# Altium schematic sheet ESP_BLE.SchDoc
size 400 x 320 mm
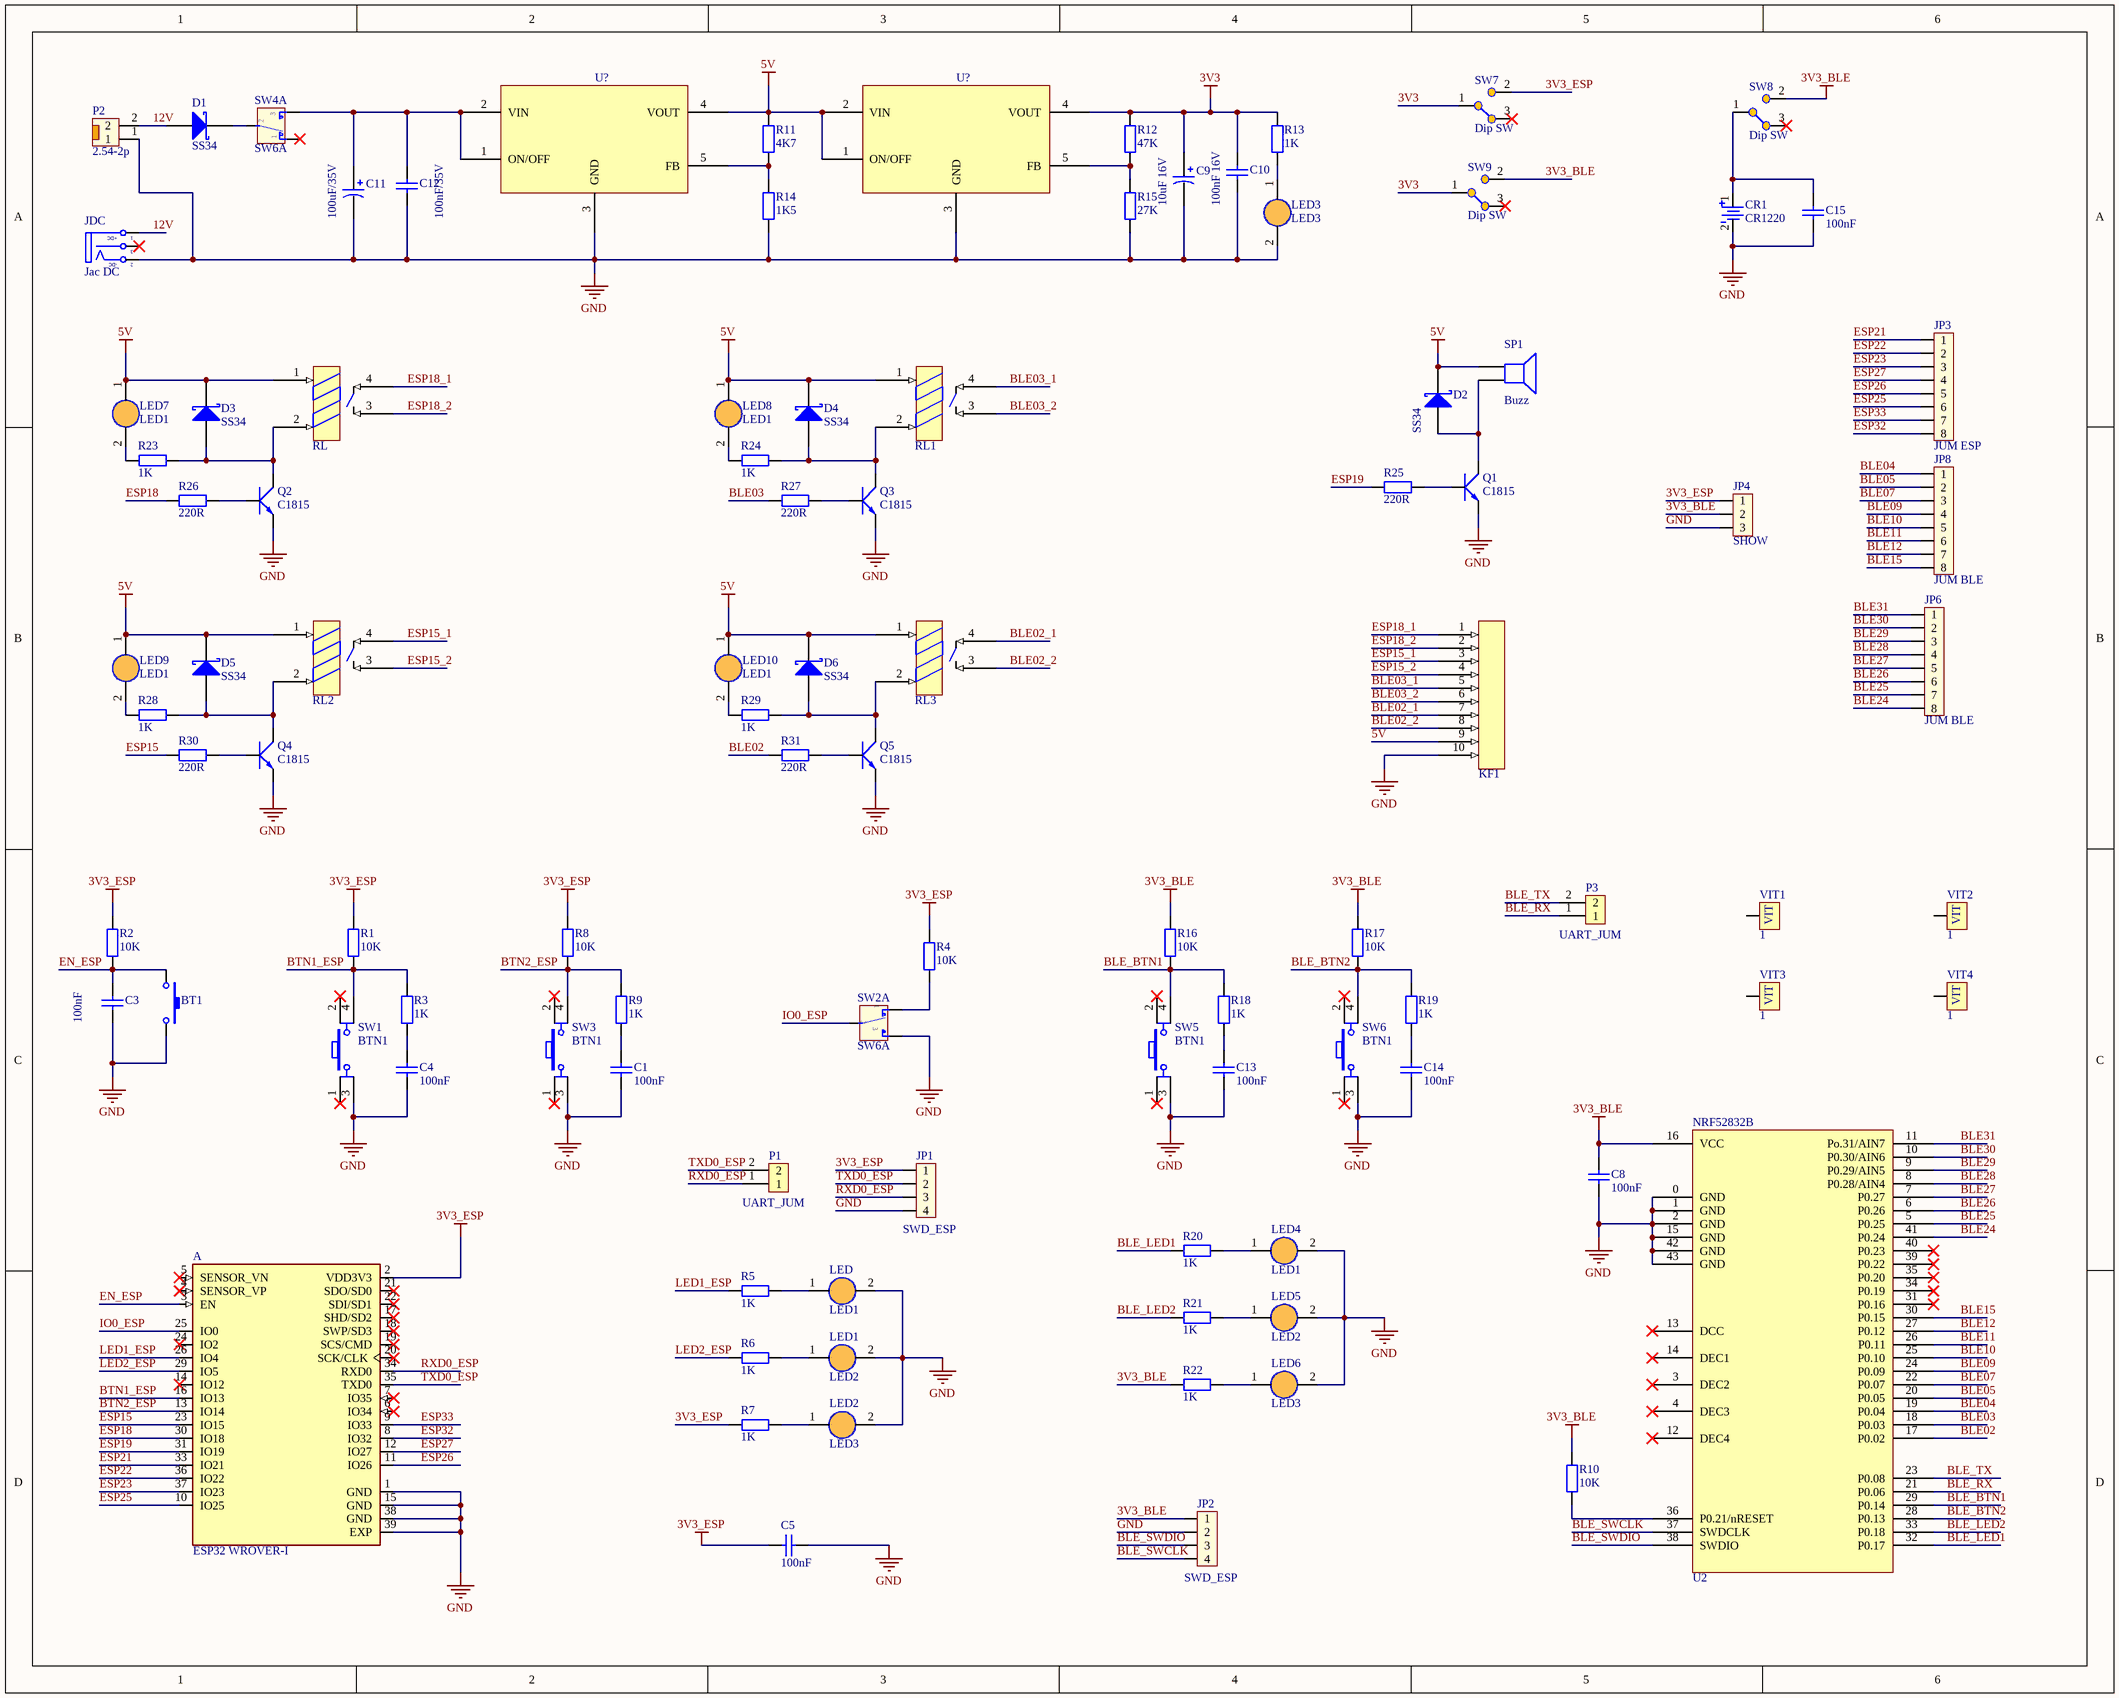
[diagram p0: ESP_BLE.SchDoc]

## Parts
A  ESP32 WROVER-I  [ESP32-WROVER-I]
BT1  Nút Nhấn 2 Chân 3x6x2.5MM SMD  [Nut Nhan 2 Chan SMD_N]  (value not drawn)
C1  100nF  [tu 0805]
C3  100nF  [tu 0805]
C4  100nF  [tu 0805]
C5  100nF  [tu 0805]
C8  100nF  [tu 0805]
C9  10uF 16V  [CAP_ALUM_SMD_5054_TYPE_C]
C10  100nF 16V  [tu 0805]
C11  100uF/35V  [CAP_ALUM_SMD_100102_TYPE_G]
C12  100nF/35V  [tu 0805]
C13  100nF  [tu 0805]
C14  100nF  [tu 0805]
C15  100nF  [tu 0805]
CR1  CR1220  [CR1220_HOLDER_SMD]
D1  SS34  [DIODE_DO214AC_SMA]
D2  SS34  [DIODE_DO214AC_SMA]
D3  SS34  [DIODE_DO214AC_SMA]
D4  SS34  [DIODE_DO214AC_SMA]
D5  SS34  [DIODE_DO214AC_SMA]
D6  SS34  [DIODE_DO214AC_SMA]
JDC  Jac DC  [DC-IN]
JP1  SWD_ESP  [JUMP DON DUC 2.54_4P]
JP2  SWD_ESP  [JUMP DON DUC 2.54_4P]
JP3  JUM ESP  [Jump Don Duc Thang 2.54_8p]
JP4  SHOW  [jump don duc thang 2.54_3p]
JP6  JUM BLE  [Jump Don Duc Thang 2.54_8p]
JP8  JUM BLE  [Jump Don Duc Thang 2.54_8p]
KF1  KF142R-10  [KF10]  (value not drawn)
LED  LED1  [led 0805]
LED1  LED2  [led 0805]
LED2  LED3  [led 0805]
LED3  LED3  [led 0805]
LED4  LED1  [led 0805]
LED5  LED2  [led 0805]
LED6  LED3  [led 0805]
LED7  LED1  [led 0805]
LED8  LED1  [led 0805]
LED9  LED1  [led 0805]
LED10  LED1  [led 0805]
MIC1  U?  [Mic5V]
MIC2  U?  [Mic5V]
NRF52832  U2  [NRF52832]  (part B of 2)
P1  UART_JUM  [Jump don duc 2.54_2P]
P2  2.54-2p  [Header Duc Thang 2P 2.54]
P3  UART_JUM  [Jump don duc 2.54_2P]
Q1  C1815  [SOT23B]
Q2  C1815  [SOT23B]
Q3  C1815  [SOT23B]
Q4  C1815  [SOT23B]
Q5  C1815  [SOT23B]
R1  10K  [tro 0805]
R2  10K  [tro 0805]
R3  1K  [tro 0805]
R4  10K  [tro 0805]
R5  1K  [tro 0805]
R6  1K  [tro 0805]
R7  1K  [tro 0805]
R8  10K  [tro 0805]
R9  1K  [tro 0805]
R10  10K  [tro 0805]
R11  4K7  [tro 0805]
R12  47K  [tro 0805]
R13  1K  [tro 0805]
R14  1K5  [tro 0805]
R15  27K  [tro 0805]
R16  10K  [tro 0805]
R17  10K  [tro 0805]
R18  1K  [tro 0805]
R19  1K  [tro 0805]
R20  1K  [tro 0805]
R21  1K  [tro 0805]
R22  1K  [tro 0805]
R23  1K  [tro 0805]
R24  1K  [tro 0805]
R25  220R  [tro 0805]
R26  220R  [tro 0805]
R27  220R  [tro 0805]
R28  1K  [tro 0805]
R29  1K  [tro 0805]
R30  220R  [tro 0805]
R31  220R  [tro 0805]
RL  Relay-4  [Relay-4]  (value not drawn)
RL1  Relay-4  [Relay-4]  (value not drawn)
RL2  Relay-4  [Relay-4]  (value not drawn)
RL3  Relay-4  [Relay-4]  (value not drawn)
SP1  Buzz  [SPEAKER]
SW1  BTN1  [SW-4P-S]
SW2  SW6A  [SW6]  (part A of 2)
SW3  BTN1  [SW-4P-S]
SW4  SW6A  [SW6]  (part A of 2)
SW5  BTN1  [SW-4P-S]
SW6  BTN1  [SW-4P-S]
SW7  Dip SW  [SW3P]
SW8  Dip SW  [SW3P]
SW9  Dip SW  [SW3P]
VIT1  1  [VIT]
VIT2  1  [VIT]
VIT3  1  [VIT]
VIT4  1  [VIT]

## Nets
3V3: C9.1 C10.1 MIC2.4(VOUT) R12.2 R13.2 SW7.1(COM) SW9.1(COM)
3V3_BLE: C8.1 JP2.1 JP4.2 NRF52832.16(VCC) R10.2 R16.2 R17.2 R22.1 SW8.2(NC) SW9.2(NC)
3V3_ESP: A.2(VDD3V3) C5.1 JP1.1 JP4.1 R1.2 R2.2 R4.2 R7.1 R8.2 SW7.2(NC)
5V: D2.2(K) D3.2(K) D4.2(K) D5.2(K) D6.2(K) KF1.9 LED7.1(A) LED8.1(A) LED9.1(A) LED10.1(A) MIC1.4(VOUT) MIC2.1(ON/OFF) MIC2.2(VIN) R11.2 RL.1 RL1.1 RL2.1 RL3.1 SP1.1
GND: A.1(GND) A.15(GND) A.38(GND) A.39(EXP) BT1.2 C1.2 C3.2 C4.2 C5.2 C8.2 C9.2 C10.2 C11.2 C12.2 C13.2 C14.2 C15.2 CR1.2(-) JDC.2(TN) JP1.4 JP2.2 JP4.3 KF1.10 LED.2(K) LED1.2(K) LED2.2(K) LED3.2(K) LED4.2(K) LED5.2(K) LED6.2(K) MIC1.3(GND) MIC2.3(GND) NRF52832.0(GND) NRF52832.1(GND) NRF52832.2(GND) NRF52832.15(GND) NRF52832.42(GND) NRF52832.43(GND) P2.1 Q1.1(E) Q2.1(E) Q3.1(E) Q4.1(E) Q5.1(E) R14.1 R15.1 SW1.3 SW2.3 SW3.3 SW5.3 SW6.3
12V: D1.1(A) JDC.1(T) P2.2
BLE02: NRF52832.17(P0.02) R31.2
BLE02_1: KF1.7 RL3.4
BLE02_2: KF1.8 RL3.3
BLE03: NRF52832.18(P0.03) R27.2
BLE03_1: KF1.5 RL1.4
BLE03_2: KF1.6 RL1.3
BLE04: JP8.1 NRF52832.19(P0.04)
BLE05: JP8.2 NRF52832.20(P0.05)
BLE07: JP8.3 NRF52832.22(P0.07)
BLE09: JP8.4 NRF52832.24(P0.09)
BLE10: JP8.5 NRF52832.25(P0.10)
BLE11: JP8.6 NRF52832.26(P0.11)
BLE12: JP8.7 NRF52832.27(P0.12)
BLE15: JP8.8 NRF52832.30(P0.15)
BLE24: JP6.8 NRF52832.41(P0.24)
BLE25: JP6.7 NRF52832.5(P0.25)
BLE26: JP6.6 NRF52832.6(P0.26)
BLE27: JP6.5 NRF52832.7(P0.27)
BLE28: JP6.4 NRF52832.8(P0.28/AIN4)
BLE29: JP6.3 NRF52832.9(P0.29/AIN5)
BLE30: JP6.2 NRF52832.10(P0.30/AIN6)
BLE31: JP6.1 NRF52832.11(Po.31/AIN7)
BLE_BTN1: NRF52832.29(P0.14) R16.1 R18.1 SW5.4
BLE_BTN2: NRF52832.28(P0.13) R17.1 R19.1 SW6.4
BLE_LED1: NRF52832.32(P0.17) R20.1
BLE_LED2: NRF52832.33(P0.18) R21.1
BLE_RX: NRF52832.21(P0.06) P3.1
BLE_SWCLK: JP2.4 NRF52832.37(SWDCLK)
BLE_SWDIO: JP2.3 NRF52832.38(SWDIO)
BLE_TX: NRF52832.23(P0.08) P3.2
BTN1_ESP: A.16(IO13) R1.1 R3.1 SW1.4
BTN2_ESP: A.13(IO14) R8.1 R9.1 SW3.4
EN_ESP: A.3(EN) BT1.1 C3.1 R2.1
ESP15: A.23(IO15) R30.2
ESP15_1: KF1.3 RL2.4
ESP15_2: KF1.4 RL2.3
ESP18: A.30(IO18) R26.2
ESP18_1: KF1.1 RL.4
ESP18_2: KF1.2 RL.3
ESP19: A.31(IO19) R25.2
ESP21: A.33(IO21) JP3.1
ESP22: A.36(IO22) JP3.2
ESP23: A.37(IO23) JP3.3
ESP25: A.10(IO25) JP3.6
ESP26: A.11(IO26) JP3.5
ESP27: A.12(IO27) JP3.4
ESP32: A.8(IO32) JP3.8
ESP33: A.9(IO33) JP3.7
IO0_ESP: A.25(IO0) SW2.2
LED1_ESP: A.26(IO4) R5.1
LED2_ESP: A.29(IO5) R6.1
RXD0_ESP: A.34(RXD0) JP1.3 P1.1
TXD0_ESP: A.35(TXD0) JP1.2 P1.2
NetC1_1: C1.1 R9.2
NetC4_1: C4.1 R3.2
NetC11_1: C11.1 C12.1 MIC1.1(ON/OFF) MIC1.2(VIN) SW4.3
NetC13_1: C13.1 R18.2
NetC14_1: C14.1 R19.2
NetC15_1: C15.1 CR1.1(+) SW8.1(COM)
NetD1_2: D1.2(K) SW4.2
NetD2_1: D2.1(A) Q1.2(C) SP1.2
NetD3_1: D3.1(A) Q2.2(C) R23.1 RL.2
NetD4_1: D4.1(A) Q3.2(C) R24.1 RL1.2
NetD5_1: D5.1(A) Q4.2(C) R28.1 RL2.2
NetD6_1: D6.1(A) Q5.2(C) R29.1 RL3.2
NetLED1_1: LED1.1(A) R6.2
NetLED2_1: LED2.1(A) R7.2
NetLED3_1: LED3.1(A) R13.1
NetLED4_1: LED4.1(A) R20.2
NetLED5_1: LED5.1(A) R21.2
NetLED6_1: LED6.1(A) R22.2
NetLED7_2: LED7.2(K) R23.2
NetLED8_2: LED8.2(K) R24.2
NetLED9_2: LED9.2(K) R28.2
NetLED10_2: LED10.2(K) R29.2
NetLED_1: LED.1(A) R5.2
NetMIC1_5: MIC1.5(FB) R11.1 R14.2
NetMIC2_5: MIC2.5(FB) R12.1 R15.2
NetNRF52832_36: NRF52832.36(P0.21/nRESET) R10.1
NetQ1_3: Q1.3(B) R25.1
NetQ2_3: Q2.3(B) R26.1
NetQ3_3: Q3.3(B) R27.1
NetQ4_3: Q4.3(B) R30.1
NetQ5_3: Q5.3(B) R31.1
NetR4_1: R4.1 SW2.1

Not connected (* = marked no-connect by the designer): A 4(SENSOR_VP)* 5(SENSOR_VN)* 6(IO34)* 7(IO35)* 14(IO12)* 17(SHD/SD2)* 18(SWP/SD3)* 19(SCS/CMD)* 20(SCK/CLK)* 21(SDO/SD0)* 22(SDI/SD1)* 24(IO2)*; JDC 3(S)*; NRF52832 3(DEC2)* 4(DEC3)* 12(DEC4)* 13(DCC)* 14(DEC1)* 31(P0.16)* 34(P0.19)* 35(P0.20)* 39(P0.22)* 40(P0.23)*; SW1 1* 2*; SW3 1* 2*; SW4 1*; SW5 1* 2*; SW6 1* 2*; SW7 3(NO)*; SW8 3(NO)*; SW9 3(NO)*; VIT1 VIT1(1); VIT2 VIT1(1); VIT3 VIT1(1); VIT4 VIT1(1)

## Notes on the sheet
- (in symbol DCIN) +DC; -DC

## Library data of the parts
A = ESP32 WROVER-I: Bluetooth, WiFi 802.11b/g/n, Bluetooth v4.2 + EDR, Class 1, 2 and 3 Transceiver Module 2.4GHz ~ 2.5GHz Antenna Not Included, I-PEX Surface Mount; MF: Espressif Systems; Package: Module Espressif Systems; Availability: Unavailable; MP: ESP32-WROVER-I; Value: *; SnapEDA_Link: https://www.snapeda.com/parts/ESP32-WROVER-I/Espressif%20Systems/view-part/2298808/?ref=snap; Price: None
BT1 = Nut Nhan 2 Chan SMD: Dán; Don_Vi: Con; So_Chan: 2; Ma_Hang: MH001036; Kieu_Chan: *; Ten_Linh_Kien: Nút Nhấn 2 Chân 3x6x2.5MM SMD; Chung_Loai: Dán
C1 C3-C5 C8 C10 C12-C15 = Tu 0805 33nF 50V 20%: Dán; Don_Vi: Con; So_Chan: 2; Ten_Linh_Kien: Tụ 0805 33nF 50V 20%; Ma_Hang: MH007854; Kieu_Chan: *; Chung_Loai: Dán
C9 = EEE-FK1C330P: CAP ALUM 33uF 20% 16V SMD; MFR: Panasonic; Value: 33uF/16V; Solder: SMT; MPN: EEE-FK1C330P; Category: CAPACITOR; PinCount: 2
C11 = EEE-FK1C331P: CAP ALUM 330uF 20% 35V SMD; MFR: Panasonic; Value: 330uF/35V; Solder: SMT; MPN: EEE-FK1C331P; Category: CAPACITOR; PinCount: 2
D1-D6 = SS34: DIODE SCHOTTKY 40V 3A SMA; Solder: SMT; MPN: SS34; Value: SS34; MFR: *
JDC = DCIN: Jac DC input; Value: Jac DC
JP1 JP2 = Jump Don Duc 2.54_4P: Cắm; Ten_Linh_Kien: Jump Đơn Đực 2.54MM 2x40P Thẳng 11MM; Don_Vi: Con; So_Chan: 4; Kieu_Chan: *; Ma_Hang: *; Chung_Loai: Cắm
JP3 JP6 JP8 = Jump Don Duc 2.54_8P: Cắm; Ten_Linh_Kien: Jump Đơn Đực 2.54MM 1x40P Thẳng 11MM; Ma_Hang: MH000903; Don_Vi: Con; Ghi_Chu: *; Kieu Chan: *; Chung_Loai: Cắm
JP4 = Jump Don Duc 2.54_3P: Cắm; Ten_Linh_Kien: Jump Đơn Đực 2.54MM 2x40P Thẳng 11MM; Don_Vi: Con; So_Chan: 3; Kieu_Chan: *; Ma_Hang: *; Chung_Loai: Cắm
KF1 = KF10: KF142R-10P-5.08mm
LED LED1-LED10 = Led 0805 Xanh Duong: Dán; Don_Vi: Con; So_Chan: 2; Ten_Linh_Kien: LED 0805 Màu Xanh Dương (Blue); Ma_Hang: MH002327; Chung_Loai: Dán; Kieu_Chan: *
MIC1 MIC2 = Mic5V: 3A
NRF52832 = U?
P1 P3 = jump don duc 2.54_2p: Cắm; Don_Vi: Con; Ten_Linh_Kien: Jump Đơn Đực 2.54MM 1x40P Thẳng 11MM; Ma_Hang: MH000903; Chung_Loai: Cắm
P2 = Header 2.54-2p Duc Thang: Cắm; So_Chan: 2; Don_Vi: Con; Ten_Linh_Kien: Header 2P XH2.54-2P Đực Thẳng; Ma_Hang: MH001283; Chung_Loai: Cắm; Kieu_Chan: *
Q1-Q5 = C1815: NPN 600mW, ECB; Value: C1815
R1-R31 = Tro 0805 1% 0.33R: Dán; Don_Vi: Con; So_Chan: 2; Ten_Linh_Kien: Trở 0805 1% 0.33R; Ma_Hang: MH005467; Chung_Loai: Dán; Kieu_Chan: *
SP1 = Coi Chip 5V: Cắm; Ten_Linh_Kien: Còi Chip 5V 9.5x12MM; Don_Vi: Con; Ma_Hang: MH000902; Ghi_Chu: *; Kieu_Chan: *; Chung_Loai: Cắm
SW1 SW3 SW5 SW6 = Nut Nhan 4 Chan: Cắm; Value: Nút Nhấn 4 Chân 6x6x9MM DIP; Ma_Hang: MH004077; Don_Vi: Con; Kieu Chan: *; Ghi Chu: *
SW2 SW4 = SW6A: SW-DTDP - 6 Pin; Value: SW6
SW7-SW9 = Switch3P: Dip Switch 3 pin
VIT1-VIT4 = VIT: Oc Vit